# Altium schematic sheet Mcu.SchDoc: Mcu
size A3; ApprovedBy: ANBI; CheckedBy: ANBI; CompanyName: DongA FuelCell; DrawnBy: seokipo; Engineer: seokipo; Revision: 001; SheetNumber: 4; SheetTotal: 6
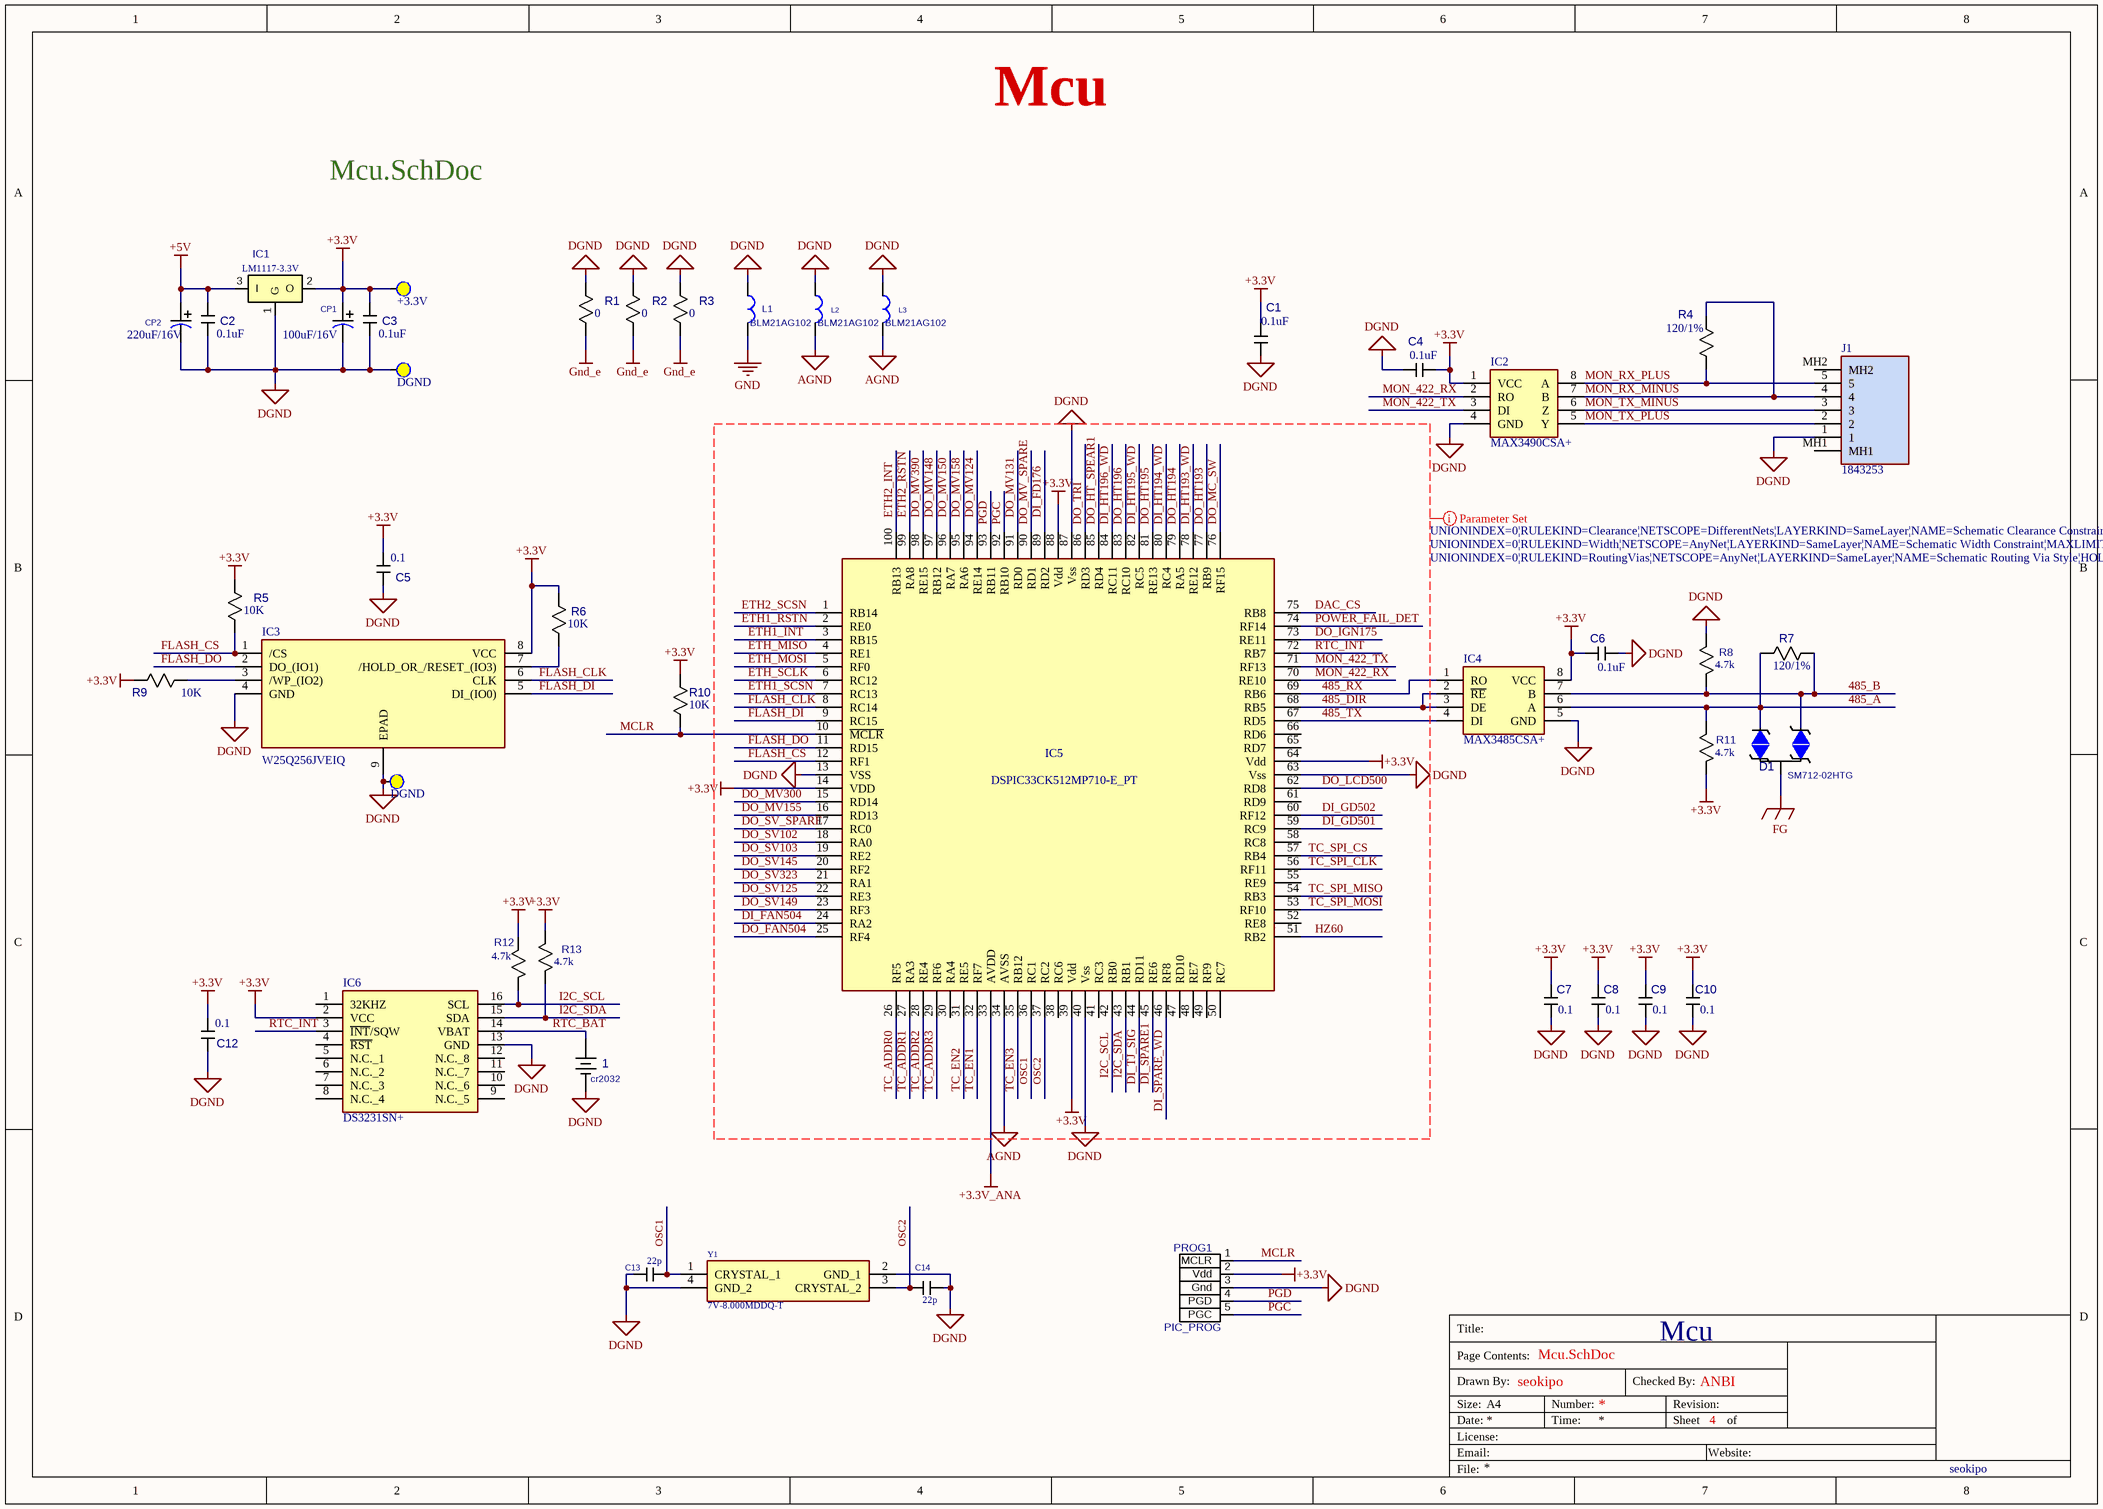
[diagram p0: Mcu.SchDoc]

## Parts
(Parts that share a designator on the sheet are numbered #1, #2 ... from top to bottom, then left to right.)
1  Part No.: cr2032  [BATT_CASE_2032]  (hidden comment: BATT_CR20)
+3.3V  Test Point_top  [TP_KEYSTONE_5000]  (value not drawn)
C1  value 0.1uF  [CC1608N]  (hidden comment: CS1608)
C2  규격: 0.1uF  [CC1608N]  (hidden comment: CS1608)
C3  규격: 0.1uF  [CC1608N]  (hidden comment: CS1608)
C4  value 0.1uF  [CC1608N]  (hidden comment: CS1608)
C5  규격: 0.1  [CC1608N]  (hidden comment: CS1608)
C6  규격: 0.1uF  [CC1608N]  (hidden comment: CS1608)
C7  규격: 0.1  [CC1608N]  (hidden comment: CS1608)
C8  규격: 0.1  [CC1608N]  (hidden comment: CS1608)
C9  규격: 0.1  [CC1608N]  (hidden comment: CS1608)
C10  규격: 0.1  [CC1608N]  (hidden comment: CS1608)
C12  규격: 0.1  [CC1608N]  (hidden comment: CS1608)
C13  규격: 22p  [CC1608N]  (hidden comment: CS1608)
C14  규격: 22p  [CC1608N]  (hidden comment: CS1608)
CP1  규격: 100uF/16V  [CP5_SMT]  (hidden comment: CP5_SMT)
CP2  규격: 220uF/16V  [CP6_SMT]  (hidden comment: CP6_SMT)
D1  Part No.: SM712-02HTG  [SOT95P240X115-3N]  (hidden comment: TVS5025)
DGND#1  Test Point_top  [TP_KEYSTONE_5000]  (value not drawn)
DGND#2  Test Point_top  [TP_KEYSTONE_5000]  (value not drawn)
IC1  Part No.: LM1117-3.3V  [SOT-223]  (hidden comment: 1117SO)
IC2  MAX3490CSA+  [SOIC127P600X175-8N]
IC3  W25Q256JVEIQ  [SON127P800X600X80-9N-D]
IC4  MAX3485CSA+  [SOIC127P600X175-8N]
IC5  DSPIC33CK512MP710-E_PT  [QFP40P1400X1400X120-100N]
IC6  DS3231SN+  [SOIC127P1032X265-16N]
J1  1843253  [1818025]
L1  Part No.: BLM21AG102  [BEADC2012X110N]  (hidden comment: L)
L2  Part No.: BLM21AG102  [BEADC2012X110N]  (hidden comment: L)
L3  Part No.: BLM21AG102  [BEADC2012X110N]  (hidden comment: L)
PROG1  PIC_PROG  [PIC_PROG]
R1  규격: 0  [R3216]  (hidden comment: R3216)
R2  규격: 0  [R3216]  (hidden comment: R3216)
R3  value 0  [R3216]  (hidden comment: R3216)
R4  value 120/1%  [R2012]  (hidden comment: R2012)
R5  규격: 10K  [RESC1608X55N]  (hidden comment: R1608)
R6  규격: 10K  [RESC1608X55N]  (hidden comment: R1608)
R7  규격: 120/1%  [R2012]  (hidden comment: R2012)
R8  규격: 4.7k  [RESC1608X55N]  (hidden comment: R1608)
R9  규격: 10K  [RESC1608X55N]  (hidden comment: R1608)
R10  규격: 10K  [RESC1608X55N]  (hidden comment: R1608)
R11  규격: 4.7k  [RESC1608X55N]  (hidden comment: R1608)
R12  value 4.7k  [RESC1608X55N]  (hidden comment: R1608)
R13  Vlaue: 4.7k  [RESC1608X55N]  (hidden comment: R1608)
Y1  7V-8.000MDDQ-T  [7M25000MEEQT]

## Nets
+3.3V: +3.3V.1(tp) C1.1 C3.2 C4.1 C5.2 C6.1 C7.2 C8.2 C9.2 C10.2 C12.2 CP1.2 IC1.2(O) IC2.1(VCC) IC3.8(VCC) IC4.8(VCC) IC5.14(VDD) IC5.39(Vdd) IC5.64(Vdd) IC5.88(Vdd) IC6.2(VCC) PROG1.2(Vdd) R5.1 R6.1 R9.1 R10.1 R11.2 R12.2 R13.2
+3.3V_ANA: IC5.33(AVDD)
+5V: C2.2 CP2.2 IC1.3(I)
AGND: IC5.34(AVSS) L2.1 L3.1
DGND: 1.2 C1.2 C2.1 C3.1 C4.2 C5.1 C6.2 C7.1 C8.1 C9.1 C10.1 C12.1 C13.2 C14.1 CP1.1 CP2.1 DGND#1.1(tp) DGND#2.1(tp) IC1.1(G) IC2.4(GND) IC3.4(GND) IC3.9(EPAD) IC4.5(GND) IC5.13(VSS) IC5.40(Vss) IC5.63(Vss) IC5.87(Vss) IC6.13(GND) J1.1 L1.2 L2.2 L3.2 PROG1.3(Gnd) R1.2 R2.2 R3.2 R8.2 Y1.2(GND_1) Y1.4(GND_2)
FG: D1.3
GND: L1.1
Gnd_e: R1.1 R2.1 R3.1
485_A: D1.2 IC4.6(A) R7.2 R11.1
485_B: D1.1 IC4.7(B) R7.1 R8.1
485_DIR: IC4.2(~{RE}) IC4.3(DE) IC5.68(RB5)
485_RX: IC4.1(RO) IC5.69(RB6)
485_TX: IC4.4(DI) IC5.67(RD5)
DAC_CS: IC5.75(RB8)
DI_FAN504: IC5.24(RA2)
DI_FD176: IC5.89(RD2)
DI_GD501: IC5.59(RC9)
DI_GD502: IC5.60(RF12)
DI_HT193_WD: IC5.78(RE12)
DI_HT194_WD: IC5.80(RC4)
DI_HT195_WD: IC5.82(RC5)
DI_HT196_WD: IC5.84(RC11)
DI_SPARE1: IC5.45(RE6)
DI_SPARE_WD: IC5.46(RF8)
DI_TJ_SIG: IC5.44(RD11)
DO_FAN504: IC5.25(RF4)
DO_HT193: IC5.77(RB9)
DO_HT194: IC5.79(RA5)
DO_HT195: IC5.81(RE13)
DO_HT196: IC5.83(RC10)
DO_HT_SPEAR1: IC5.85(RD4)
DO_IGN175: IC5.73(RE11)
DO_LCD500: IC5.62(RD8)
DO_MC_SW: IC5.76(RF15)
DO_MV124: IC5.94(RE14)
DO_MV131: IC5.91(RD0)
DO_MV148: IC5.97(RB12)
DO_MV150: IC5.96(RA7)
DO_MV155: IC5.16(RD13)
DO_MV158: IC5.95(RA6)
DO_MV300: IC5.15(RD14)
DO_MV390: IC5.98(RE15)
DO_MV_SPARE: IC5.90(RD1)
DO_SV102: IC5.18(RA0)
DO_SV103: IC5.19(RE2)
DO_SV125: IC5.22(RE3)
DO_SV145: IC5.20(RF2)
DO_SV149: IC5.23(RF3)
DO_SV323: IC5.21(RA1)
DO_SV_SPARE: IC5.17(RC0)
DO_TRI: IC5.86(RD3)
ETH1_INT: IC5.3(RB15)
ETH1_RSTN: IC5.2(RE0)
ETH1_SCSN: IC5.7(RC13)
ETH2_INT: IC5.100(RB13)
ETH2_RSTN: IC5.99(RA8)
ETH2_SCSN: IC5.1(RB14)
ETH_MISO: IC5.4(RE1)
ETH_MOSI: IC5.5(RF0)
ETH_SCLK: IC5.6(RC12)
FLASH_CLK: IC3.6(CLK) IC5.8(RC14)
FLASH_CS: IC3.1(/CS) IC5.12(RF1) R5.2
FLASH_DI: IC3.5(DI_(IO0)) IC5.9(RC15)
FLASH_DO: IC3.2(DO_(IO1)) IC5.11(RD15)
HZ60: IC5.51(RB2)
I2C_SCL: IC5.42(RB0) IC6.16(SCL) R12.1
I2C_SDA: IC5.43(RB1) IC6.15(SDA) R13.1
MCLR: IC5.10(~{MCLR}) PROG1.1(MCLR) R10.2
MON_422_RX: IC2.2(RO) IC5.70(RE10)
MON_422_TX: IC2.3(DI) IC5.71(RF13)
MON_RX_MINUS: IC2.7(B) J1.4 R4.1
MON_RX_PLUS: IC2.8(A) J1.5 R4.2
MON_TX_MINUS: IC2.6(Z) J1.3
MON_TX_PLUS: IC2.5(Y) J1.2
OSC1: C13.1 IC5.36(RC1) Y1.1(CRYSTAL_1)
OSC2: C14.2 IC5.37(RC2) Y1.3(CRYSTAL_2)
PGC: IC5.92(RB10) PROG1.5(PGC)
PGD: IC5.93(RB11) PROG1.4(PGD)
POWER_FAIL_DET: IC5.74(RF14)
RTC_BAT: 1.1 IC6.14(VBAT)
RTC_INT: IC5.72(RB7) IC6.3(~{INT}/SQW)
TC_ADDR0: IC5.26(RF5)
TC_ADDR1: IC5.27(RA3)
TC_ADDR2: IC5.28(RE4)
TC_ADDR3: IC5.29(RF6)
TC_EN1: IC5.32(RF7)
TC_EN2: IC5.31(RE5)
TC_EN3: IC5.35(RB12)
TC_SPI_CLK: IC5.56(RF11)
TC_SPI_CS: IC5.57(RB4)
TC_SPI_MISO: IC5.54(RB3)
TC_SPI_MOSI: IC5.53(RF10)
NetIC3_3: IC3.3(/WP_(IO2)) R9.2
NetIC3_7: IC3.7(/HOLD_OR_/RESET_(IO3)) R6.2

Not connected (* = marked no-connect by the designer): 1 3 4; IC1 4; IC5 30(RA4) 38(RC6) 41(RC3) 47(RD10) 48(RE7) 49(RF9) 50(RC7) 52(RE8) 55(RE9) 58(RC8) 61(RD9) 65(RD7) 66(RD6); IC6 1(32KHZ) 4(~{RST}) 5(N.C._1) 6(N.C._2) 7(N.C._3) 8(N.C._4) 9(N.C._5) 10(N.C._6) 11(N.C._7) 12(N.C._8); J1 MH1 MH2

## Layout directives
rule Clearance Constraint [Clearance = 0.15mm]; rule Width Constraint [Pref Width = 0.3mm    Min Width = 0.2mm    Max Width = 0.5mm]; rule Routing Via Style [Pref Size = 0.3mm    Pref Hole Size = 0.5mm]: 485_DIR, 485_RX, 485_TX, +3.3V, AGND, DAC_CS, DGND, DI_FAN504, DI_FD176, DI_GD501, DI_GD502, DI_HT193_WD, DI_HT194_WD, DI_HT195_WD, DI_HT196_WD, DI_SPARE1, DI_SPARE_WD, DI_TJ_SIG, DO_FAN504, DO_HT193, DO_HT194, DO_HT195, DO_HT196, DO_HT_SPEAR1, DO_IGN175, DO_LCD500, DO_MC_SW, DO_MV124, DO_MV131, DO_MV148, DO_MV150, DO_MV155, DO_MV158, DO_MV300, DO_MV390, DO_MV_SPARE, DO_SV102, DO_SV103, DO_SV125, DO_SV145, DO_SV149, DO_SV323, DO_SV_SPARE, DO_TRI, ETH1_INT, ETH1_RSTN, ETH1_SCSN, ETH2_INT, ETH2_RSTN, ETH2_SCSN, ETH_MISO, ETH_MOSI, ETH_SCLK, FLASH_CLK, FLASH_CS, FLASH_DI, FLASH_DO, HZ60, I2C_SCL, I2C_SDA, MON_422_RX, MON_422_TX, OSC1, OSC2, PGC, PGD, POWER_FAIL_DET, RTC_INT, TC_ADDR0, TC_ADDR1, TC_ADDR2, TC_ADDR3, TC_EN1, TC_EN2, TC_EN3, TC_SPI_CLK, TC_SPI_CS, TC_SPI_MISO, TC_SPI_MOSI

## Notes on the sheet
- Mcu.SchDoc
- Labels drawn without touching a wire or pin: +3.3V
- Title:
- Drawn By:
- Page Contents:
- Checked By:
- Size:
- Date:
- File:
- License:
- Email:
- A4
- Number:
- Time:
- Revision:
- Sheet
- Website:
- of

## Library data of the parts
+3.3V DGND#1 DGND#2 = Tp_5000: Pad30; Part No.: *
C1-C10 C12-C14 = CS1608: Part No.: {Part No}; Price: 6
CP1 = CP5_SMT: Part No.: {Part No}; Price: 31
CP2 = CP6_SMT: Part No.: RV16V220 6.3X7.7 (ELNA / 삼영); ComponentLink1Description: New link; ComponentLink1URL: *; Price: 40
D1 = TVS_23: Price: 370
IC1 = 1117SO: Value: {Value}; Price: {Price}
IC2 = MAX3490CSA+: Integrated Circuit; Height: 1.75mm; Part No.: MAX3490CSA+; Price: 9200
IC3 = W25Q256FVEIQ: Integrated Circuit; Height: 0.8mm; Price: 9700; Part No.: W25Q256JVEIQ
IC4 = MAX3485CSA+: Integrated Circuit; Height: 1.75mm; Part No.: MAX3485CSA+; Price: 8140
IC5 = DSPIC33CK512MP710-E_PT: Integrated Circuit; Manufacturer_Name: Microchip; Height: 1.2mm; Price: 6800; Part No.: DSPIC33CK512MP710-E_PT
IC6 = DS3231SN+: Integrated Circuit; Height: 2.65mm; Part No.: DS3231SN+; Price: 8400
J1 = 1818025: MCV 1,5/ 5-GF-3,5-LR - PCB headers, nominal cross section: 1.5 mm<sup>2</sup>, color: green, nominal current: 8 A, rated voltage (III/2): 160 V, contact surface: Sn, contact connection type: Pin, number of potentials: 5, number of rows: 1, number of positions: 5, number of connections: 5, product range: MCV 1,5/..-GF-LR, pitch: 3.5 mm, mounting: Wave soldering, pin layout: Linear pinning, solder pin [P]: 3.4 mm, number of solder pins per potential: 1, plug-in system: COMBICON MC 1,5, Pin connector pattern a; Manufacturer_Name: Phoenix Contact; Geometry.Height: 9.35mm; Part No.: 1843253; Price: 8230
L1-L3 = BEAD2012
R1-R3 = R3216: Part No.: {Part No}; Price: {Price}
R4 = R2012: Part No.: WR06X1200FT(120R)F; Price: 2
R5 R6 R9 R10 R12 R13 = R1608: Part No.: {Part No}; Price: {Price}
R7 = R2012: Part No.: {Part No}; Price: 2
R8 R11 = R1608: Part No.: WR06X472JT(4.7KR)J; Price: 1
Y1 = 7M-25.000MEEQ-T: Crystal or Oscillator; Height: 0.8mm; Price: 1100; Part No.: 7V-8.000MDDQ-T
PROG1 = PIC_PROG: Part No.: *; Price: {Price}